# Altium schematic sheet Clock.SchDoc
size A4
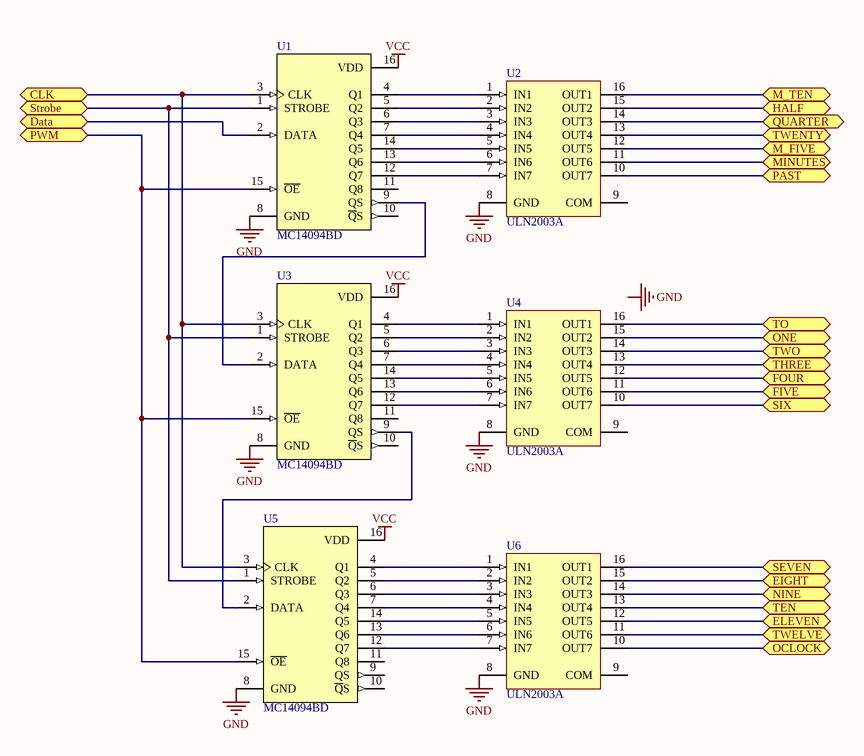
[diagram p0: Clock.SchDoc]

## Parts
U1  MC14094BD  [751B-05_N]
U2  ULN2003A  [DIP16]
U3  MC14094BD  [751B-05_N]
U4  ULN2003A  [DIP16]
U5  MC14094BD  [751B-05_N]
U6  ULN2003A  [DIP16]

## Ports
CLK, Data, EIGHT, ELEVEN, FIVE, FOUR, HALF, M_FIVE, M_TEN, MINUTES, NINE, OCLOCK, ONE, PAST, PWM, QUARTER, SEVEN, SIX, Strobe, TEN, THREE, TO, TWELVE, TWENTY, TWO

## Nets
GND: U1.8(GND) U2.8(GND) U3.8(GND) U4.8(GND) U5.8(GND) U6.8(GND)
VCC: U1.16(VDD) U3.16(VDD) U5.16(VDD)
CLK: U1.3(CLK) U3.3(CLK) U5.3(CLK) ; port CLK
Data: U1.2(DATA) ; port Data
EIGHT: U6.15(OUT2) ; port EIGHT
ELEVEN: U6.12(OUT5) ; port ELEVEN
FIVE: U4.11(OUT6) ; port FIVE
FOUR: U4.12(OUT5) ; port FOUR
HALF: U2.15(OUT2) ; port HALF
M_FIVE: U2.12(OUT5) ; port M_FIVE
M_TEN: U2.16(OUT1) ; port M_TEN
MINUTES: U2.11(OUT6) ; port MINUTES
NINE: U6.14(OUT3) ; port NINE
OCLOCK: U6.10(OUT7) ; port OCLOCK
ONE: U4.15(OUT2) ; port ONE
PAST: U2.10(OUT7) ; port PAST
PWM: U1.15(~{OE}) U3.15(~{OE}) U5.15(~{OE}) ; port PWM
QUARTER: U2.14(OUT3) ; port QUARTER
SEVEN: U6.16(OUT1) ; port SEVEN
SIX: U4.10(OUT7) ; port SIX
Strobe: U1.1(STROBE) U3.1(STROBE) U5.1(STROBE) ; port Strobe
TEN: U6.13(OUT4) ; port TEN
THREE: U4.13(OUT4) ; port THREE
TO: U4.16(OUT1) ; port TO
TWELVE: U6.11(OUT6) ; port TWELVE
TWENTY: U2.13(OUT4) ; port TWENTY
TWO: U4.14(OUT3) ; port TWO
NetU1_4: U1.4(Q1) U2.1(IN1)
NetU1_5: U1.5(Q2) U2.2(IN2)
NetU1_6: U1.6(Q3) U2.3(IN3)
NetU1_7: U1.7(Q4) U2.4(IN4)
NetU1_9: U1.9(QS) U3.2(DATA)
NetU1_12: U1.12(Q7) U2.7(IN7)
NetU1_13: U1.13(Q6) U2.6(IN6)
NetU1_14: U1.14(Q5) U2.5(IN5)
NetU3_4: U3.4(Q1) U4.1(IN1)
NetU3_5: U3.5(Q2) U4.2(IN2)
NetU3_6: U3.6(Q3) U4.3(IN3)
NetU3_7: U3.7(Q4) U4.4(IN4)
NetU3_9: U3.9(QS) U5.2(DATA)
NetU3_12: U3.12(Q7) U4.7(IN7)
NetU3_13: U3.13(Q6) U4.6(IN6)
NetU3_14: U3.14(Q5) U4.5(IN5)
NetU5_4: U5.4(Q1) U6.1(IN1)
NetU5_5: U5.5(Q2) U6.2(IN2)
NetU5_6: U5.6(Q3) U6.3(IN3)
NetU5_7: U5.7(Q4) U6.4(IN4)
NetU5_12: U5.12(Q7) U6.7(IN7)
NetU5_13: U5.13(Q6) U6.6(IN6)
NetU5_14: U5.14(Q5) U6.5(IN5)

Not connected (* = marked no-connect by the designer): U1 10(~{Q}S) 11(Q8); U2 9(COM); U3 10(~{Q}S) 11(Q8); U4 9(COM); U5 9(QS) 10(~{Q}S) 11(Q8); U6 9(COM)

## Notes on the sheet
- Labels drawn without touching a wire or pin: GND

## Library data of the parts
U1 U3 U5 = MC14094BD: 8-Stage Shift/Store Register with 3-State Outputs; Published: 15-Apr-2002; LatestRevisionDate: 13-Apr-2006; LatestRevisionNote: IPC-7351 Footprint Added.; DatasheetVersion: 1995; PackageVersion: Oct-1999; PackageReference: 751B-05; Publisher: Altium Limited; PackageDescription: 16-Pin Small Outline Integrated Circuit 1.27 mm Pitch; Code_JEDEC: MS-012-AC; Code_IPC: SOIC127P600-16; ComponentLink1Description: Manufacturer Link; ComponentLink1URL: http://www.onsemi.com/; ComponentLink2Description: Datasheet; ComponentLink2URL: http://www.onsemi.com/pub/Collateral/MC14094B-D.PDF
U2 U4 U6 = ULN2003A: Seven Darlington Array; Published: 8-Jun-2000; LatestRevisionDate: 06-Jun-2005; LatestRevisionNote: Stylized 3D Model Added.; DatasheetVersion: Sep-1998; PackageVersion: Apr-1996; PackageReference: DIP16; Publisher: Altium Limited; PackageDescription: DIP; 16 Leads; Row Spacing 7.62 mm; Pitch 2.54 mm; ComponentLink1Description: Manufacturer Link; ComponentLink1URL: http://www.st.com/; ComponentLink2Description: Datasheet; ComponentLink2URL: http://www.st.com/stonline/products/literature/ds/5279/uln2001.pdf